# Altium schematic sheet W5500.SchDoc
size A4
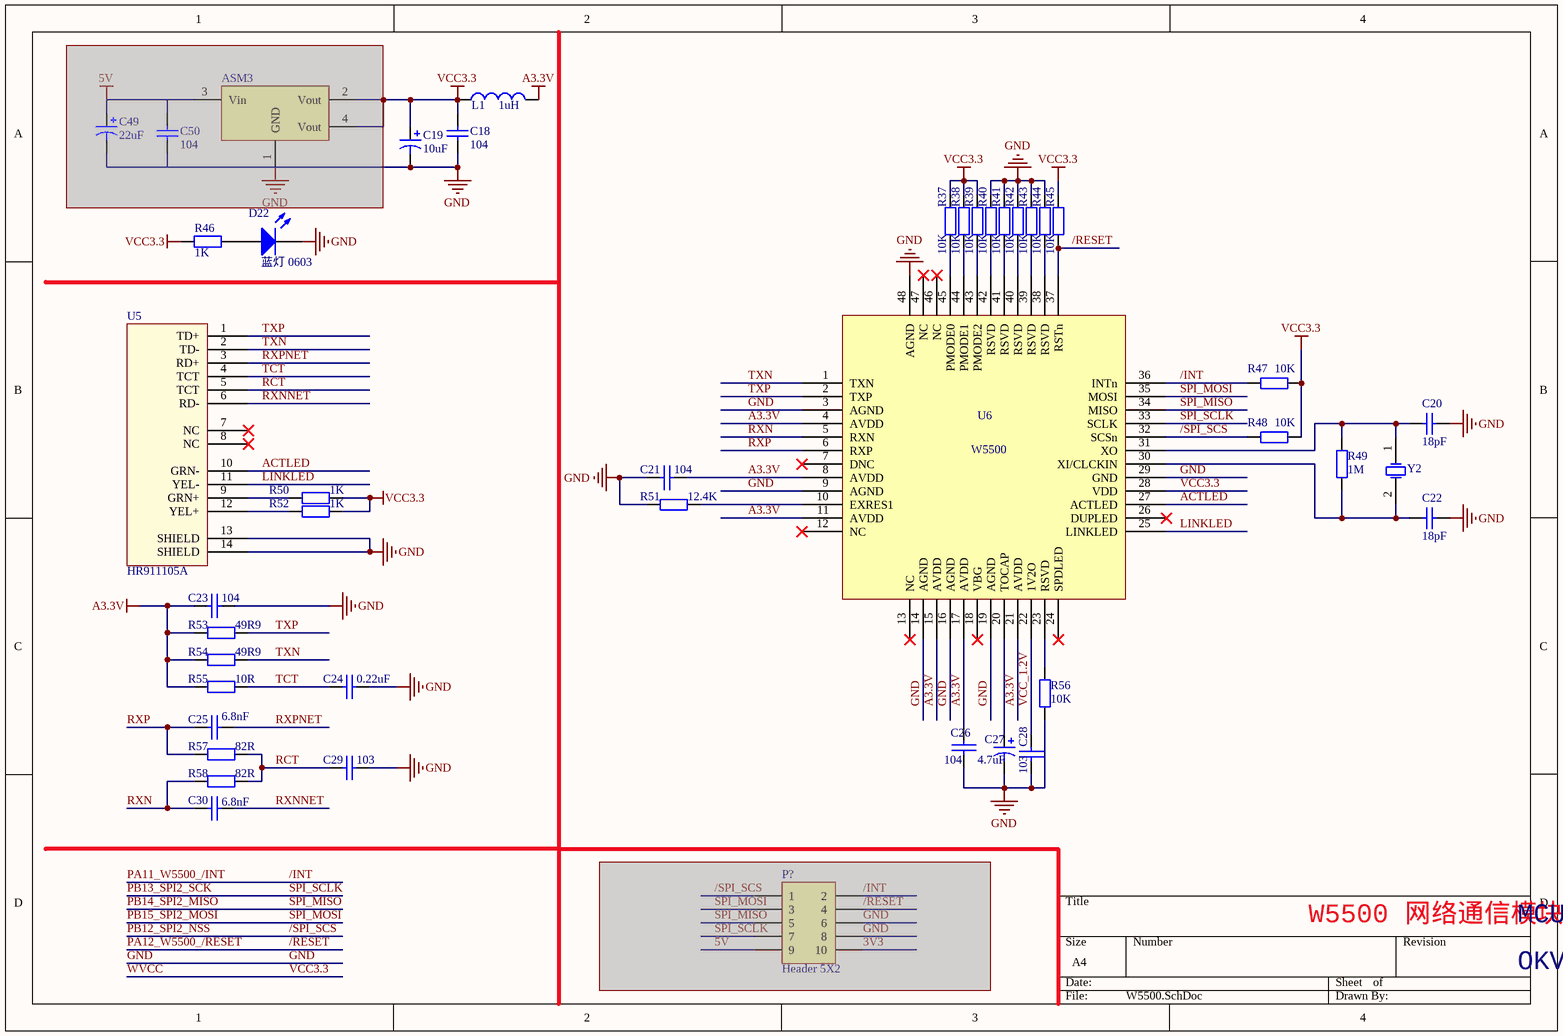
[diagram p0: W5500.SchDoc]

## Parts
ASM3  ASM1117-3.3  [LC-SOT-89(SOT-89-3)]  (value not drawn)  (masked out: inside a compile mask, not in the netlist)
C18  104  [LC-0603_C]
C19  10uF  [LC-CASE-A_3216]
C20  18pF  [LC-0603_C]
C21  104  [LC-0603_C]
C22  18pF  [LC-0603_C]
C23  104  [LC-0603_C]
C24  0.22uF  [LC-0603_C]
C25  6.8nF  [LC-0603_C]
C26  104  [LC-0603_C]
C27  4.7uF  [LC-CASE-A_3216]
C28  103  [LC-0603_C]
C29  103  [LC-0603_C]
C30  6.8nF  [LC-0603_C]
C49  22uF  [LC-CASE-B_3528]  (masked out: inside a compile mask, not in the netlist)
C50  104  [LC-0603_C]  (masked out: inside a compile mask, not in the netlist)
D22  蓝灯 0603  [LC-0603_LED_S1]
L1  1uH  [LC-0805_L]
P?  Header 5X2  [F2.54-2*5]  (masked out: inside a compile mask, not in the netlist)
R37  10K  [LC-0603_R]
R38  10K  [LC-0603_R]
R39  10K  [LC-0603_R]
R40  10K  [LC-0603_R]
R41  10K  [LC-0603_R]
R42  10K  [LC-0603_R]
R43  10K  [LC-0603_R]
R44  10K  [LC-0603_R]
R45  10K  [LC-0603_R]
R46  1K  [LC-0603_R]
R47  10K  [LC-0603_R]
R48  10K  [LC-0603_R]
R49  1M  [LC-0603_R]
R50  1K  [LC-0603_R]
R51  12.4K  [LC-0603_R]
R52  1K  [LC-0603_R]
R53  49R9  [LC-0603_R]
R54  49R9  [LC-0603_R]
R55  10R  [LC-0603_R]
R56  10K  [LC-0603_R]
R57  82R  [LC-0603_R]
R58  82R  [LC-0603_R]
U5  HR911105A  [HR911105A]
U6  W5500  [LQFP48]
Y2  25MHz  [LC-HC-49SMD]  (value not drawn)

## Nets
A3.3V: C21.2 C23.2 C26.1 L1.2 R53.1 R54.1 R55.1 U6.4(AVDD) U6.8(AVDD) U6.11(AVDD) U6.15(AVDD) U6.17(AVDD) U6.21(AVDD)
GND: C18.1 C19.2 C20.1 C21.1 C22.1 C23.1 C24.2 C26.2 C27.2 C28.2 C29.1 D22.K R40.1 R41.1 R42.1 R43.1 R44.1 R51.2 R56.2 U5.13(SHIELD) U5.14(SHIELD) U6.3(AGND) U6.9(AGND) U6.14(AGND) U6.16(AGND) U6.19(AGND) U6.29(GND) U6.48(AGND)
VCC3.3: C18.2 C19.1 L1.1 R37.1 R38.1 R39.1 R45.1 R46.2 R47.1 R48.1 R50.2 R52.2 U6.28(VDD)  [also labelled WVCC]
/INT: R47.2 U6.36(INTn)  [also labelled PA11_W5500_/INT]
/RESET: R45.2 U6.37(RSTn)  [also labelled PA12_W5500_/RESET]
/SPI_SCS: R48.2 U6.32(SCSn)  [also labelled PB12_SPI2_NSS]
ACTLED: U5.10(GRN-) U6.27(ACTLED)
LINKLED: U5.11(YEL-) U6.25(LINKLED)
PB13_SPI2_SCK: U6.33(SCLK)  [also labelled SPI_SCLK]
PB14_SPI2_MISO: U6.34(MISO)  [also labelled SPI_MISO]
PB15_SPI2_MOSI: U6.35(MOSI)  [also labelled SPI_MOSI]
RCT: C29.2 R57.2 R58.2 U5.5(TCT)
RXN: C30.1 R58.1 U6.5(RXN)
RXNNET: C30.2 U5.6(RD-)
RXP: C25.1 R57.1 U6.6(RXP)
RXPNET: C25.2 U5.3(RD+)
TCT: C24.1 R55.2 U5.4(TCT)
TXN: R54.2 U5.2(TD-) U6.1(TXN)
TXP: R53.2 U5.1(TD+) U6.2(TXP)
VCC_1.2V: C28.1 U6.22(1V2O)
NetC20_2: C20.2 R49.2 U6.31(XO) Y2.1(OSC1)
NetC22_2: C22.2 R49.1 U6.30(XI/CLCKIN) Y2.2(OSC2)
NetC27_1: C27.1 U6.20(TOCAP)
NetD22_A: D22.A R46.1
NetR37_2: R37.2 U6.45(PMODE0)
NetR38_2: R38.2 U6.44(PMODE1)
NetR39_2: R39.2 U6.43(PMODE2)
NetR40_2: R40.2 U6.42(RSVD)
NetR41_2: R41.2 U6.41(RSVD)
NetR42_2: R42.2 U6.40(RSVD)
NetR43_2: R43.2 U6.39(RSVD)
NetR44_2: R44.2 U6.38(RSVD)
NetR50_1: R50.1 U5.9(GRN+)
NetR51_1: R51.1 U6.10(EXRES1)
NetR52_1: R52.1 U5.12(YEL+)
NetR56_1: R56.1 U6.23(RSVD)

Not connected (* = marked no-connect by the designer): U5 7(NC)* 8(NC)*; U6 7(DNC)* 12(NC)* 13(NC)* 18(VBG)* 24(SPDLED)* 26(DUPLED)* 46(NC)* 47(NC)*

## Notes on the sheet
- W5500 网络通信模块
- MCU板
- OKV0.0.0

## Library data of the parts
ASM3 = VOLTREG1
C18 C20 C22 C50 = Cap: Capacitor; Published: 8-Jun-2000; LatestRevisionDate: 17-Jul-2002; LatestRevisionNote: Re-released for DXP Platform.; PackageReference: RAD-0.3; Publisher: Altium Limited
  C18 C50: Value: 104
  C20 C22: Value: 18pF
C19 C27 C49 = Cap Pol3: Polarized Capacitor (Surface Mount); Published: 8-Jun-2000; LatestRevisionDate: 17-Jul-2002; LatestRevisionNote: Re-released for DXP Platform.; PackageReference: C0805; Publisher: Altium Limited
  C19: Value: 10uF
  C27: Value: 4.7uF
  C49: Value: 22uF
C21 C23-C26 C28-C30 = CAP: Capacitor
D22 = 0603 蓝灯: 发光二极管; ComponentLink1Description: 供应商链接; ComponentLink1URL: http://www.szlcsc.com/product/details_73150.html; Package: 0603; Supplier: LC; SuppliersPartNumber: C72041
L1 = Inductor: Code_IEC: 1005; Published: 8-Jun-2000; LatestRevisionDate: 17-Jul-2002; LatestRevisionNote: Re-released for DXP Platform.; PackageReference: 0402-A; Publisher: Altium Limited; Code_JEITA: 0402; Value: 1uH
P? = Header 5X2: Header, 5-Pin, Dual row; LatestRevisionDate: 17-Jul-2002; LatestRevisionNote: Re-released for DXP Platform.; Publisher: Altium Limited
R37-R50 R52 R55-R58 = Res2: Resistor; Published: 8-Jun-2000; LatestRevisionDate: 17-Jul-2002; LatestRevisionNote: Re-released for DXP Platform.; PackageReference: AXIAL-0.4; Publisher: Altium Limited
  R37-R45 R47 R48 R56: Value: 10K
  R46 R50 R52: Value: 1K
  R49: Value: 1M
  R55: Value: 10R
  R57 R58: Value: 82R
R51 = Res2: Resistor; Value: 12.4K 1%; Published: 8-Jun-2000; LatestRevisionDate: 17-Jul-2002; LatestRevisionNote: Re-released for DXP Platform.; PackageReference: AXIAL-0.4; Publisher: Altium Limited
R53 R54 = Res2: Resistor; Value: 49.9R; Published: 8-Jun-2000; LatestRevisionDate: 17-Jul-2002; LatestRevisionNote: Re-released for DXP Platform.; PackageReference: AXIAL-0.4; Publisher: Altium Limited
U6 = W5500: W5500以太网芯片
Y2 = XTAL: Crystal Oscillator; Published: 8-Jun-2000; LatestRevisionDate: 17-Jul-2002; LatestRevisionNote: Re-released for DXP Platform.; PackageReference: R38; Publisher: Altium Limited